# Altium schematic sheet Connectors.SchDoc
size A
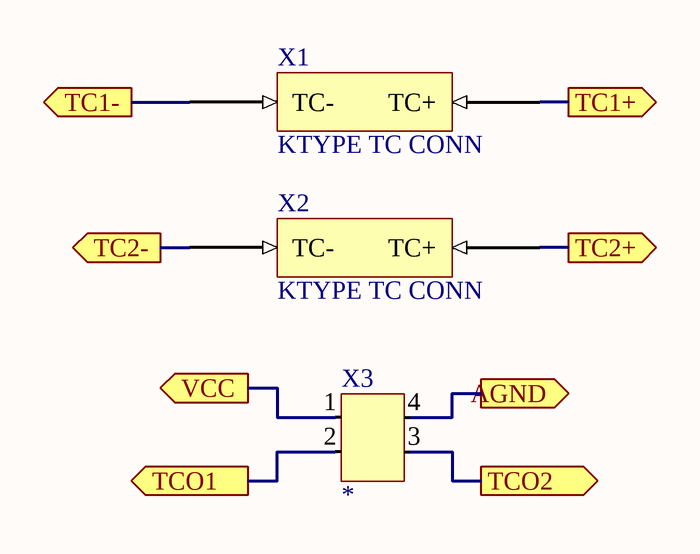
[diagram p0: Connectors.SchDoc]

## Parts
X1  KTYPE TC CONN  [KTYPE TC CONN]
X2  KTYPE TC CONN  [KTYPE TC CONN]
X3  *  [DTF13-4P]

## Ports
AGND (out), TC1+ (out), TC1- (out), TC2+ (out), TC2- (out), TCO1 (out), TCO2 (out), VCC (out)

## Nets
AGND: X3.4 ; port AGND
TC1+: X1.TC+ ; port TC1+
TC1-: X1.TC- ; port TC1-
TC2+: X2.TC+ ; port TC2+
TC2-: X2.TC- ; port TC2-
TCO1: X3.2 ; port TCO1
TCO2: X3.3 ; port TCO2
VCC: X3.1 ; port VCC

## Library data of the parts
X1 X2 = 35: K type thermocouple vertical conn; id: 35; numcontacts: 2; numrows: 1; pitch: 0; updatedby: gutmanndan; name: KTYPE TC CONN; quantity: 0; package: 1; link: https://evosensors.com/products/k1x-femx-con-fp-x-pccs; createdby: gutmanndan; createddate: 11/20/2019 7:50:17 PM; updateddate: 11/20/2019 7:50:17 PM
X3 = 15: DTF13-4P; id: 15; numcontacts: 4; MfrPartNo: *; name: DTF13-4P; quantity: 0; link: https://www.te.com/usa-en/product-DTF13-4P.html